# Altium project uESC_HW.PrjPcb
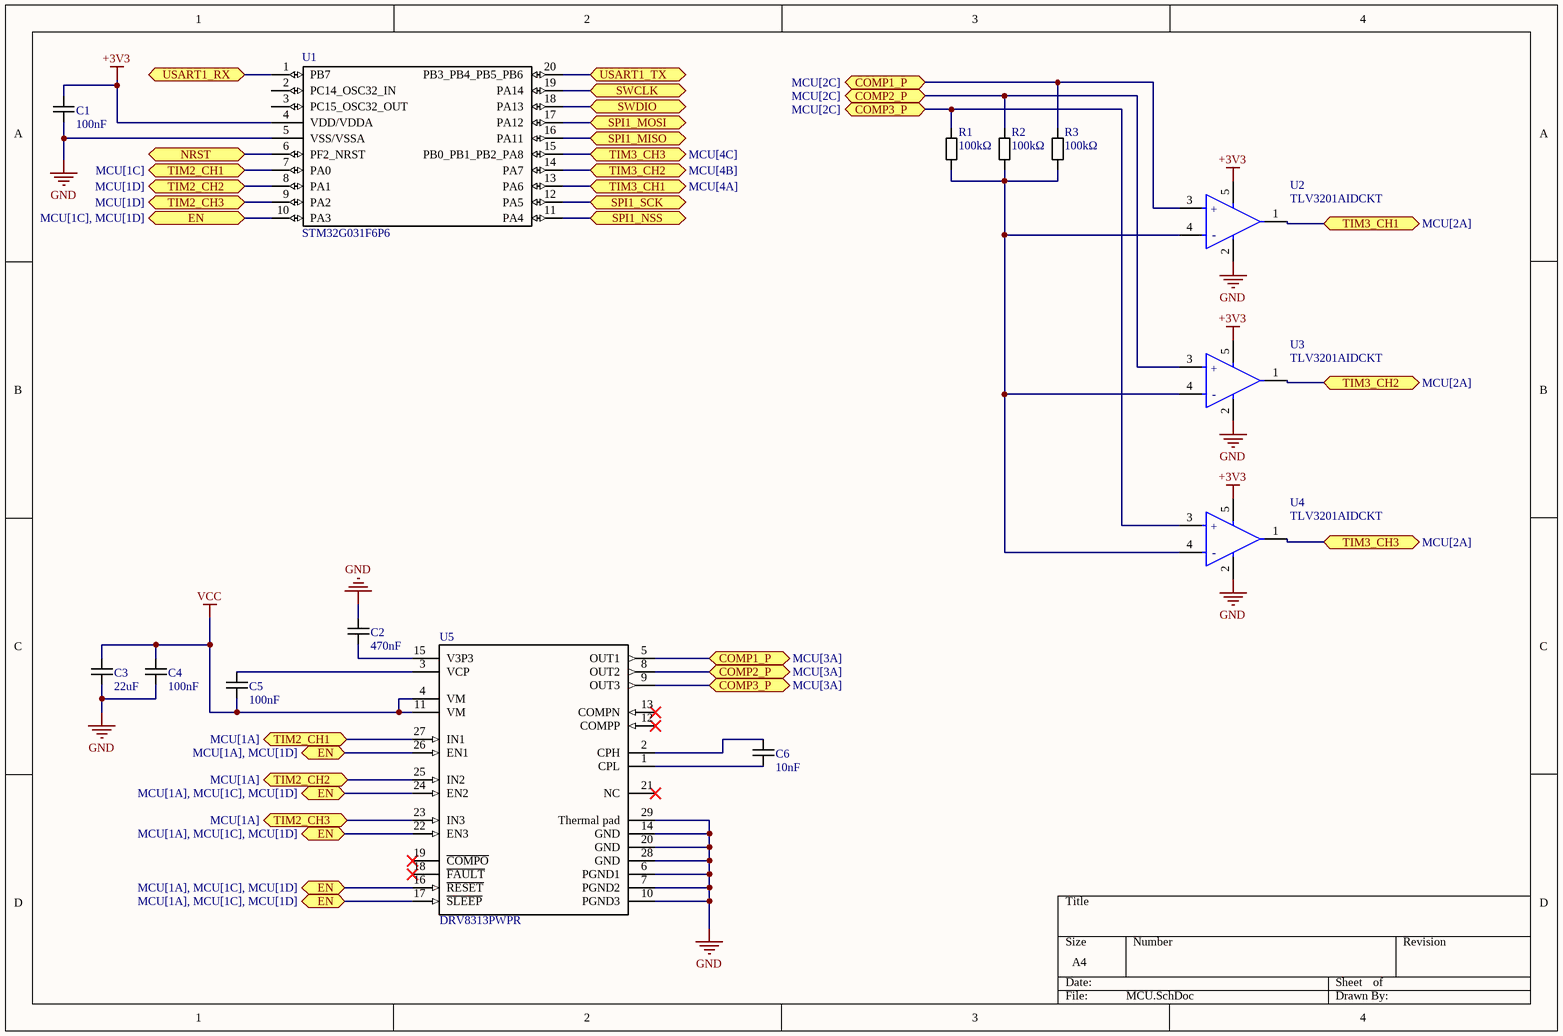
[diagram p0: MCU.SchDoc]
1 sheet, 14 parts. Net scope: flat (ports and power ports of the same name join across sheets).
Board file: PCB1.PcbDoc

## Sheet MCU.SchDoc
size A4; SheetNumber: 1; SheetTotal: 1

### Parts
C1  100nF  [Capacitor 0603]
C2  470nF  [Capacitor 0603]
C3  22uF  [Capacitor 0603]
C4  100nF  [Capacitor 0603]
C5  100nF  [Capacitor 0603]
C6  10nF  [Capacitor 0603]
R1  100kΩ  [Resistor 0603]
R2  100kΩ  [Resistor 0603]
R3  100kΩ  [Resistor 0603]
U1  STM32G031F6P6  [TSSOP20]
U2  TLV3201AIDCKT  [SC70]
U3  TLV3201AIDCKT  [SC70]
U4  TLV3201AIDCKT  [SC70]
U5  DRV8313PWPR  [FP-PWP0028C-IPC_A]

### Ports
COMP1_P (bidir, see MCU[2C]), COMP1_P (bidir, see MCU[3A]), COMP2_P (bidir, see MCU[2C]), COMP2_P (bidir, see MCU[3A]), COMP3_P (bidir, see MCU[2C]), COMP3_P (bidir, see MCU[3A]), EN (bidir, see MCU[1A], MCU[1C], MCU[1D]), EN (bidir, see MCU[1A], MCU[1D]), EN (bidir, see MCU[1C], MCU[1D]), NRST (bidir), SPI1_MISO (bidir), SPI1_MOSI (bidir), SPI1_NSS (bidir), SPI1_SCK (bidir), SWCLK (bidir), SWDIO (bidir), TIM2_CH1 (bidir, see MCU[1A]), TIM2_CH1 (bidir, see MCU[1C]), TIM2_CH2 (bidir, see MCU[1A]), TIM2_CH2 (bidir, see MCU[1D]), TIM2_CH3 (bidir, see MCU[1A]), TIM2_CH3 (bidir, see MCU[1D]), TIM3_CH1 (bidir, see MCU[2A]), TIM3_CH1 (bidir, see MCU[4A]), TIM3_CH2 (bidir, see MCU[2A]), TIM3_CH2 (bidir, see MCU[4B]), TIM3_CH3 (bidir, see MCU[2A]), TIM3_CH3 (bidir, see MCU[4C]), USART1_RX (bidir), USART1_TX (bidir)

### Nets
+3V3: C1.2 U1.4(VDD/VDDA) U2.5(VCC) U3.5(VCC) U4.5(VCC)
GND: C1.1 C2.2 C3.1 C4.1 U1.5(VSS/VSSA) U2.2(GND) U3.2(GND) U4.2(GND) U5.6(PGND1) U5.7(PGND2) U5.10(PGND3) U5.14(GND) U5.20(GND) U5.28(GND) U5.29(Thermal_pad)
VCC: C3.2 C4.2 C5.1 U5.4(VM) U5.11(VM)
NetC2_1: C2.1 U5.15(V3P3)
NetC5_2: C5.2 U5.3(VCP)
NetC6_1: C6.1 U5.1(CPL)
NetC6_2: C6.2 U5.2(CPH)
NetR1_1: R1.1 R2.1 R3.1 U2.4(IN-) U3.4(IN-) U4.4(IN-)
NetR1_2: R1.2 U4.3(IN+) U5.9(OUT3) ; port COMP3_P
NetR2_2: R2.2 U3.3(IN+) U5.8(OUT2) ; port COMP2_P
NetR3_2: R3.2 U2.3(IN+) U5.5(OUT1) ; port COMP1_P
NetU1_1: U1.1(PB7) ; port USART1_RX
NetU1_6: U1.6(PF2_NRST) ; port NRST
NetU1_7: U1.7(PA0) U5.27(IN1) ; port TIM2_CH1
NetU1_8: U1.8(PA1) U5.25(IN2) ; port TIM2_CH2
NetU1_9: U1.9(PA2) U5.23(IN3) ; port TIM2_CH3
NetU1_10: U1.10(PA3) U5.16(~{RESET}) U5.17(~{SLEEP}) U5.22(EN3) U5.24(EN2) U5.26(EN1) ; port EN
NetU1_11: U1.11(PA4) ; port SPI1_NSS
NetU1_12: U1.12(PA5) ; port SPI1_SCK
NetU1_13: U1.13(PA6) U2.1(OUT) ; port TIM3_CH1
NetU1_14: U1.14(PA7) U3.1(OUT) ; port TIM3_CH2
NetU1_15: U1.15(PB0_PB1_PB2_PA8) U4.1(OUT) ; port TIM3_CH3
NetU1_16: U1.16(PA11) ; port SPI1_MISO
NetU1_17: U1.17(PA12) ; port SPI1_MOSI
NetU1_18: U1.18(PA13) ; port SWDIO
NetU1_19: U1.19(PA14) ; port SWCLK
NetU1_20: U1.20(PB3_PB4_PB5_PB6) ; port USART1_TX

Not connected (* = marked no-connect by the designer): U1 2(PC14_OSC32_IN) 3(PC15_OSC32_OUT); U5 12(COMPP)* 13(COMPN)* 18(~{FAULT})* 19(~{COMPO})* 21(NC)*

### Notes on the sheet
- (in symbol TLV3201AIDCKT) +

### Library data of the parts
C1-C6 = Capacitor 0603: Generic 0603 Capacitor
R1-R3 = Resistor 0603: Generic 0603 Resistor
U2-U4 = TLV3201AIDCKT: IC COMPARATOR RRI SGL SC70-5; Number of Elements: 1; Nominal Supply Current: 50uA; Min Supply Voltage: 2.7V; Power Supply Rejection Ratio (PSRR): 85dB; Max Input Current: 5nA; Output Type: PUSH-PULL; Max Supply Current: 40uA; Common Mode Rejection Ratio: 70dB; Hysteresis: 1.2mV; Propagation Delay: 50ns; Response Time: 40ns; Input Offset Voltage (Vos): 5mV; Max Supply Voltage: 5.5V; Number of Pins: 5; Radiation Hardening: No; Height: 1mm; Packaging: Tape and Reel; Min Operating Temperature: -40°C; RoHS Compliant: Yes; Width: 1.4mm; Length: 2.15mm; Case/Package: SC; Input Bias Current: 5nA; Mount: Surface Mount; REACH SVHC: No SVHC; Max Operating Temperature: 125°C; Supply Current: 50uA; Lead Free: Lead Free; Quiescent Current: 40uA; Package Quantity: 250; Contact Plating: Gold; Series: -; Type: General Purpose; Number of Channels: 1
U5 = CMP-04915-000025-1: IC MOTOR DRIVER 8V-60V 28HTSSOP; Min Supply Voltage: 8V; Max Supply Voltage: 60V; Interface: Parallel; Output Current: 1.75A; Number of Outputs: 1; Logic Function: AND GATE; Package Quantity: 2000; Number of Pins: 28; Case/Package: HTSSOP; Min Operating Temperature: -40°C; Mount: Surface Mount; Series: -; Packaging: Tape and Reel; Max Operating Temperature: 125°C; Lead Free: Lead Free